# Altium schematic sheet BV100011_ControlRS485.SchDoc
size B
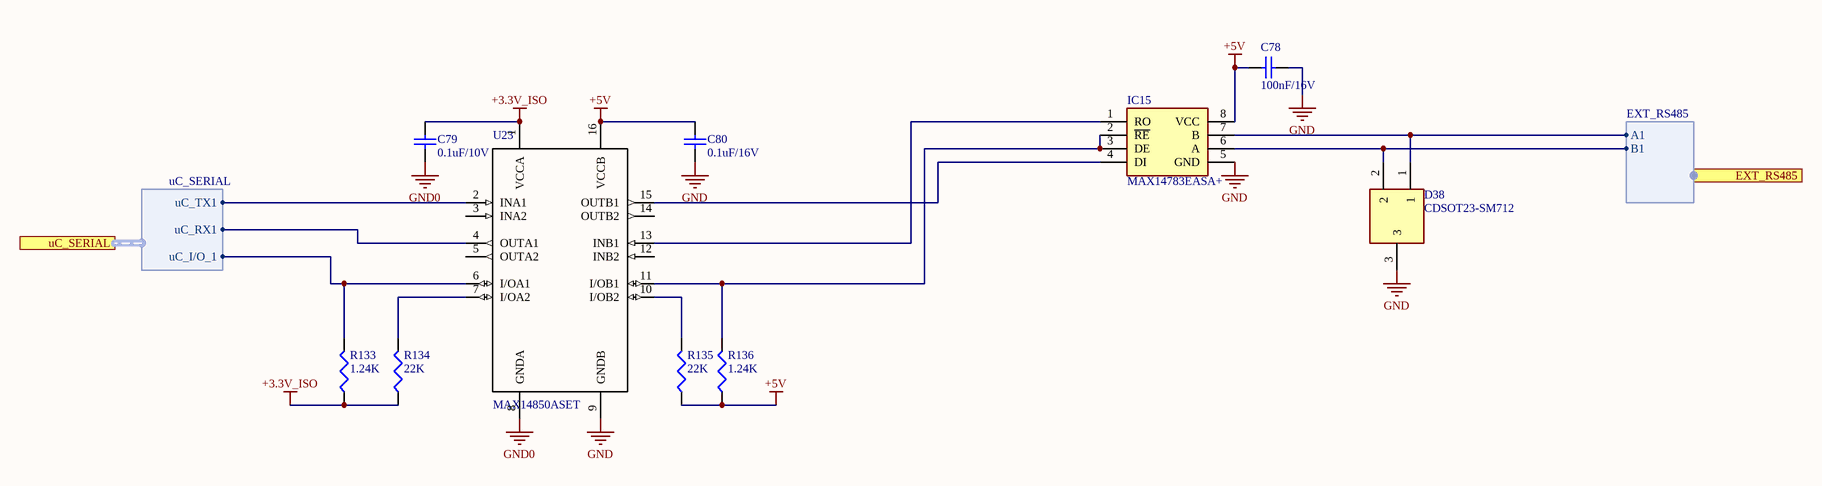
[diagram p0: BV100011_ControlRS485.SchDoc]

## Parts
C78  100nF/16V  [C1206]
C79  0.1uF/10V  [C1206]
C80  0.1uF/16V  [C1206]
D38  CDSOT23-SM712  [SOT95P230X117-3N]
IC15  MAX14783EASA+  [SOIC127P600X175-8N]
R133  1.24K  [J1-0603]
R134  22K  [J1-0603]
R135  22K  [C1206]
R136  1.24K  [C1206]
U23  MAX14850ASET  [*SOIC127P600X175-16N]

## Ports
EXT_RS485 (harness EXT_RS485), uC_SERIAL (harness uC_SERIAL)

## Harnesses
uC_SERIAL: uC_TX1, uC_RX1, uC_I/O_1
EXT_RS485: A1, B1

## Nets
+3.3V_ISO: C79.1 R133.1 R134.1 U23.1(VCCA)
+5V: C78.1 C80.1 IC15.8(VCC) R135.1 R136.1 U23.16(VCCB)
GND: C78.2 C80.2 D38.3 IC15.5(GND) U23.9(GNDB)
GND0: C79.2 U23.8(GNDA)
NetD38_1: D38.1 IC15.7(B) ; port EXT_RS485.A1
NetD38_2: D38.2 IC15.6(A) ; port EXT_RS485.B1
NetIC15_1: IC15.1(RO) U23.13(INB1)
NetIC15_2: IC15.2(~{RE}) IC15.3(DE) R136.2 U23.11(I/OB1)
NetIC15_4: IC15.4(DI) U23.15(OUTB1)
NetR133_2: R133.2 U23.6(I/OA1) ; port uC_SERIAL.uC_I/O_1
NetR134_2: R134.2 U23.7(I/OA2)
NetR135_2: R135.2 U23.10(I/OB2)
NetU23_2: U23.2(INA1) ; port uC_SERIAL.uC_TX1
NetU23_4: U23.4(OUTA1) ; port uC_SERIAL.uC_RX1

Not connected (* = marked no-connect by the designer): U23 3(INA2) 5(OUTA2) 12(INB2) 14(OUTB2)

## Library data of the parts
C78-C80 = Cap Semi: Capacitor (Semiconductor SIM Model); Published: 8-Jun-2000; LatestRevisionDate: 29-May-2009; LatestRevisionNote: IPC-7351 Footprint Added.; PackageReference: C1206; Publisher: Altium Limited; PackageDescription: Chip Capacitor
  C78: Value: 100nF/16V
  C79: Value: 0.1uF/10V
  C80: Value: 0.1uF/16V
D38 = CDSOT23-SM712: Diode; Manufacturer_Name: Bourns; Allied_Number: 70154680; Datasheet Link: http://uk.rs-online.com/web/p/products/7673728; Height: 1.17mm; Manufacturer_Part_Number: CDSOT23-SM712; Mouser Part Number: 652-CDSOT23-SM712; Mouser Price/Stock: https://www.mouser.com/Search/Refine.aspx?Keyword=652-CDSOT23-SM712; RS Part Number: 7673728P; RS Price/Stock: http://uk.rs-online.com/web/p/products/7673728P; Allied Price/Stock: https://www.alliedelec.com/bourns-cdsot23-sm712/70154680/
IC15 = MAX14783EASA+: Integrated Circuit; Manufacturer_Name: Maxim Integrated; Datasheet Link: https://datasheets.maximintegrated.com/en/ds/MAX14783E.pdf; Height: 1.75mm; Manufacturer_Part_Number: MAX14783EASA+; Mouser Part Number: 700-MAX14783EASA+; Mouser Price/Stock: https://www.mouser.com/Search/Refine.aspx?Keyword=700-MAX14783EASA%2B
R133-R136 = Res3: Resistor; Published: 8-Jun-2000; LatestRevisionDate: 29-May-2009; LatestRevisionNote: IPC-7351 Footprint Added.; PackageReference: J1-0603; Publisher: Altium Limited; PackageDescription: Chip Resistor
  R133 R136: Value: 1.24K
  R134 R135: Value: 22K
U23 = MAX14850ASET: Digital Isolator, 6-Ch, 30ns, Nsoic-16; MF: Maxim Integrated; MP: MAX14850ASE+; SnapEDA_Link: https://www.snapeda.com/parts/MAX14850ASE%2B/Maxim%20Integrated/view-part/?ref=snap; Availability: Unavailable; Price: None; Package: SOIC-16 Maxim; Value: *